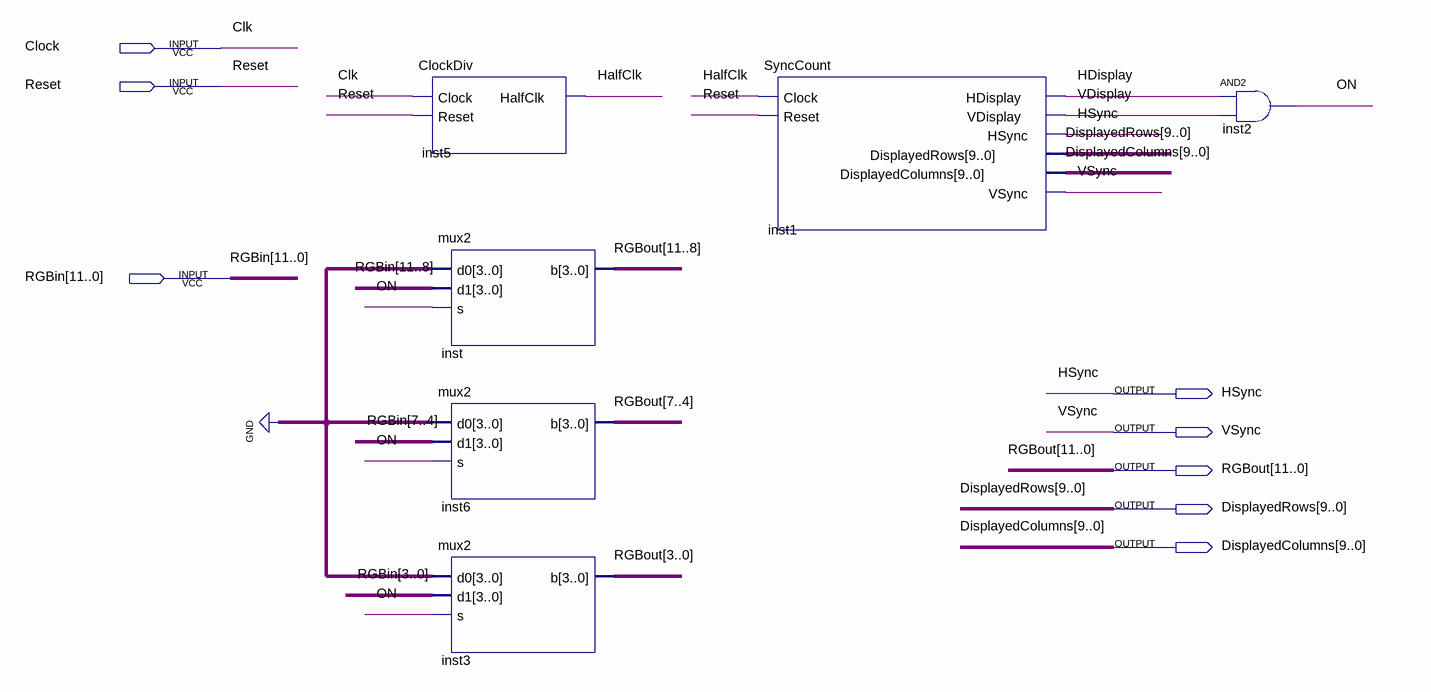
[diagram p0: schematic sheet]
// Quartus schematic Lab6.bdf as structural Verilog: 6 symbols, 8 pins
module Lab6 (
  input  Clock,
  input  Reset,
  input  [11:0] RGBin,
  output HSync,
  output VSync,
  output [11:0] RGBout,
  output [9:0] DisplayedRows,
  output [9:0] DisplayedColumns
);

  wire HalfClk, HDisplay, ON, VDisplay;

  ClockDiv inst5 (.Clock(Clock), .Reset(Reset), .HalfClk(HalfClk));
  mux2 inst (.d0(4'b0000), .d1(RGBin[11:8]), .s(ON), .b(RGBout[11:8]));
  mux2 inst6 (.d0(4'b0000), .d1(RGBin[7:4]), .s(ON), .b(RGBout[7:4]));
  mux2 inst3 (.d0(4'b0000), .d1(RGBin[3:0]), .s(ON), .b(RGBout[3:0]));
  SyncCount inst1 (
    .Clock(HalfClk), .Reset(Reset), .HDisplay(HDisplay), .VDisplay(VDisplay), .HSync(HSync),
    .DisplayedRows(DisplayedRows), .DisplayedColumns(DisplayedColumns), .VSync(VSync));
  and inst2 (ON, HDisplay, VDisplay);

  // Other names for the same wires on the sheet: Clk = Clock
endmodule
